# Altium project RasberryPTCC.PrjPcb
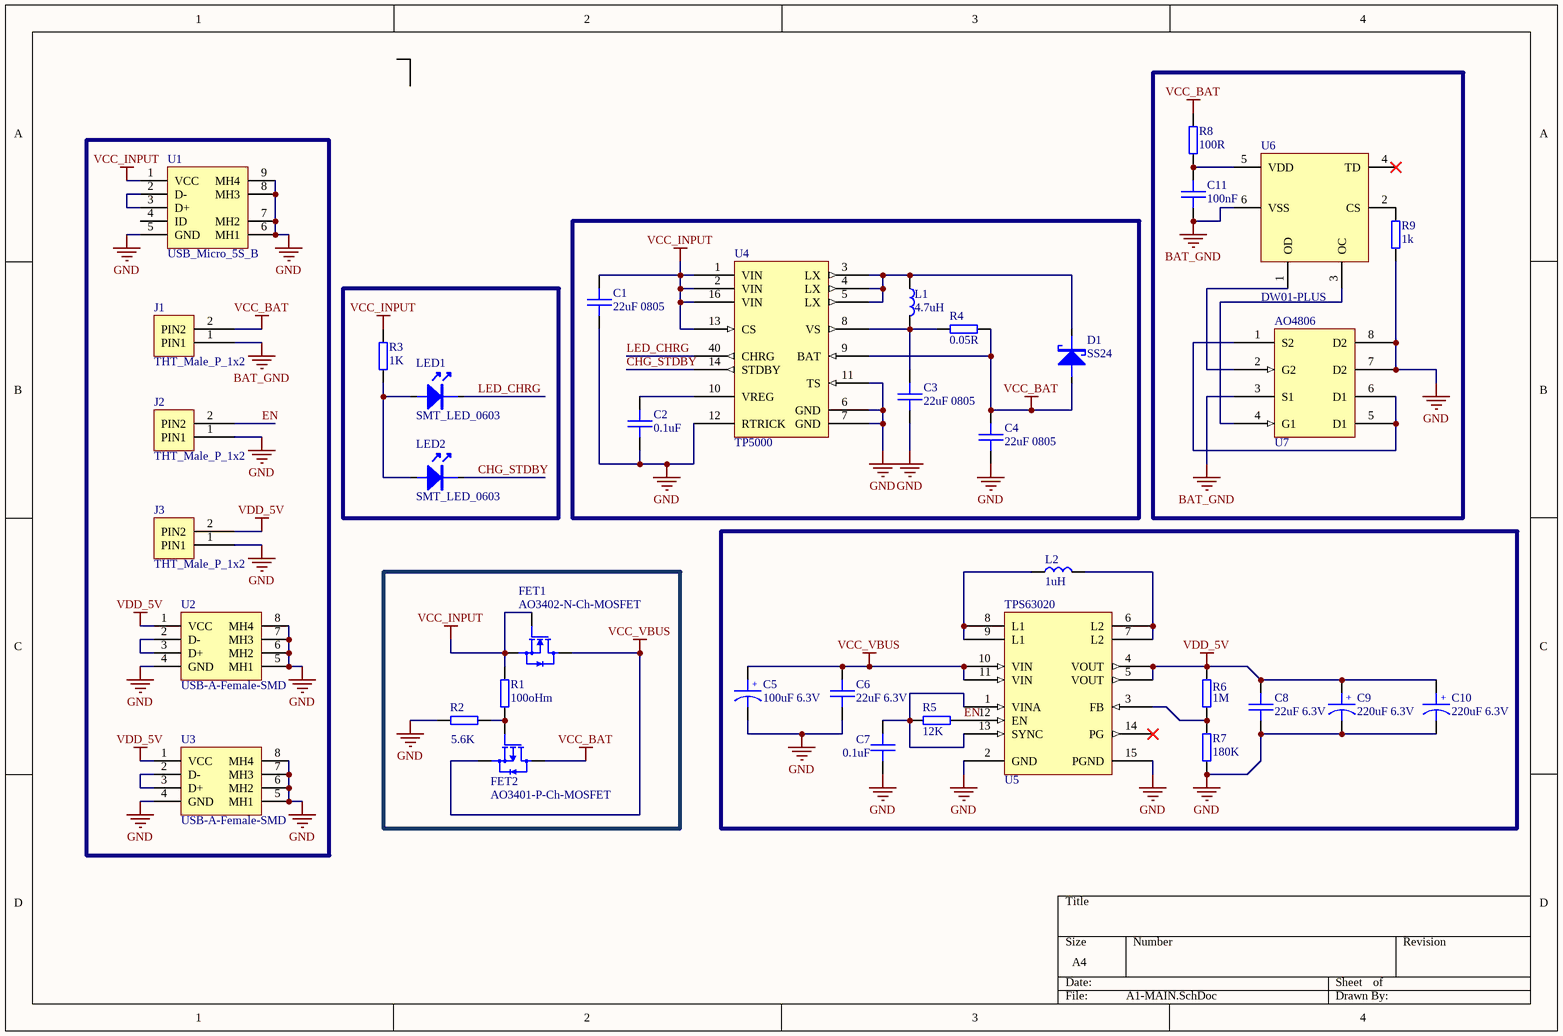
[diagram p0: A1-MAIN.SchDoc]
1 sheet, 37 parts. Net scope: global (net labels, ports and power ports of the same name join across sheets).
Board files: A00B01-AST.PcbDoc, A00B02-PURE.PcbDoc, A00B02-拼版.PcbDoc

## Sheet A1-MAIN.SchDoc
size A4

### Parts
AO4806  U7  [SOP-8]
C1  22uF 0805  [SMT_C_0805]
C2  0.1uF  [SMT_C_0603]
C3  22uF 0805  [SMT_C_0805]
C4  22uF 0805  [SMT_C_0805]
C5  100uF 6.3V  [SMT_C_Tantalum_A]
C6  22uF 6.3V  [SMT_C_0805]
C7  0.1uF  [SMT_C_0603]
C8  22uF 6.3V  [SMT_C_0805]
C9  220uF 6.3V  [SMT_C_Tantalum_B]
C10  220uF 6.3V  [SMT_C_Tantalum_B]
C11  100nF  [SMT_C_0603]
D1  SS24  [SMT_DIODE_DO_214AC]
FET1  AO3402-N-Ch-MOSFET  [AO3402-N-Ch-MOSFET]
FET2  AO3401-P-Ch-MOSFET  [AO3401-P-Ch-MOSFET]
J1  THT_Male_P_1x2  [THT_Male_P_1x2-2.54mm]
J2  THT_Male_P_1x2  [THT_Male_P_1x2-2.54mm]
J3  THT_Male_P_1x2  [THT_Male_P_1x2-2.54mm]
L1  4.7uH  [SMT_L_11.5mm]
L2  1uH  [SMT_L_11.5mm]
LED1  SMT_LED_0603  [SMT_LED_0603]
LED2  SMT_LED_0603  [SMT_LED_0603]
R1  100oHm  [SMT_R_0603]
R2  5.6K  [SMT_R_0603]
R3  1K  [SMT_R_0603]
R4  0.05R  [1210]
R5  12K  [SMT_R_0603]
R6  1M  [SMT_R_0603]
R7  180K  [SMT_R_0603]
R8  100R  [SMT_R_0603]
R9  1k  [SMT_R_0603]
TPS63020  U5  [VSON-14]
U1  USB_Micro_5S_B  [USB_MICRO_5S_B]
U2  USB-A-Female-SMD  [USB-A-SMD]
U3  USB-A-Female-SMD  [USB-A-SMD]
U4  TP5000  [QFN-16]
U6  DW01-PLUS  [SOT23-6]

### Nets
BAT_GND: AO4806.3(S1) C11.1 J1.1(PIN1) U6.6(VSS)
GND: AO4806.7(D2) AO4806.8(D2) C1.2 C2.1 C3.2 C4.2 C5.2 C6.2 C7.2 C8.2 C9.2 C10.2 J2.1(PIN1) J3.1(PIN1) R2.2 R7.1 R9.1 TPS63020.2(GND) TPS63020.15(PGND) U1.5(GND) U1.6(MH1) U1.7(MH2) U1.8(MH3) U1.9(MH4) U2.4(GND) U2.5(MH1) U2.6(MH2) U2.7(MH3) U2.8(MH4) U3.4(GND) U3.5(MH1) U3.6(MH2) U3.7(MH3) U3.8(MH4) U4.6(GND) U4.7(GND) U4.11(TS) U4.12(RTRICK)
VCC_BAT: C4.1 D1.1(A) FET2.3(D) J1.2(PIN2) R4.1 R8.1 U4.9(BAT)
VCC_INPUT: C1.1 FET1.1(G) FET1.2(S) R1.1 R3.2 U1.1(VCC) U4.1(VIN) U4.2(VIN) U4.13(CS) U4.16(VIN)
VCC_VBUS: C5.1 C6.1 FET1.3(D) FET2.2(S) TPS63020.10(VIN) TPS63020.11(VIN)
VDD_5V: C8.1 C9.1 C10.1 J3.2(PIN2) R6.2 TPS63020.4(VOUT) TPS63020.5(VOUT) U2.1(VCC) U3.1(VCC)
CHG_STDBY: LED2.2(K) U4.14(STDBY)
EN: J2.2(PIN2) R5.2 TPS63020.12(EN)
LED_CHRG: LED1.2(K) U4.40(CHRG)
NetAO4806_1: AO4806.1(S2) AO4806.5(D1) AO4806.6(D1)
NetAO4806_2: AO4806.2(G2) U6.1(OD)
NetAO4806_4: AO4806.4(G1) U6.3(OC)
NetC2_2: C2.2 U4.10(VREG)
NetC3_1: C3.1 L1.1 R4.2 U4.8(VS)
NetC7_1: C7.1 R5.1 TPS63020.1(VINA) TPS63020.13(SYNC)
NetC11_2: C11.2 R8.2 U6.5(VDD)
NetD1_2: D1.2(K) L1.2 U4.3(LX) U4.4(LX) U4.5(LX)
NetFET2_1: FET2.1(G) R1.2 R2.1
NetL2_1: L2.1 TPS63020.6(L2) TPS63020.7(L2)
NetL2_2: L2.2 TPS63020.8(L1) TPS63020.9(L1)
NetLED1_1: LED1.1(A) LED2.1(A) R3.1
NetR6_1: R6.1 R7.2 TPS63020.3(FB)
NetR9_2: R9.2 U6.2(CS)
NetU1_2: U1.2(D-) U1.3(D+)
NetU2_2: U2.2(D-) U2.3(D+)
NetU3_2: U3.2(D-) U3.3(D+)

Not connected (* = marked no-connect by the designer): TPS63020 14(PG)*; U1 4(ID); U6 4(TD)*

### Notes on the sheet
- (in symbol SMT_C_Tantalum_A) +
- (in symbol SMT_C_Tantalum_B) +

### Library data of the parts
AO4806 = AO4806
C1 C3 C4 C6 C8 = SMT_C_0805: Surface mount capacitor 0805
C2 C7 C11 = SMT_C_0603: Surface mount capacitor 0603
C5 = SMT_C_Tantalum_A: Capacitor, SM Tantalum; Body 3.2 x 1.6 mm (LxW typ)
C9 C10 = SMT_C_Tantalum_B: Capacitor, SM Tantalum; Body 3.5 x 2.8 mm (LxW typ)
D1 = SMT_DIODE_SCHOTTKY_DO_214AC: Surface mount schottky diode DO-214AC(SMA) Package
FET1 = AO3402-N-Ch-MOSFET: AO3402-N-Ch,4A,30V.RDS(ON) = 0.11Ω @ VGS = 2.5V
FET2 = AO3401-P-Ch-MOSFET: AO3401-P-Ch,-4.2A, -30V.RDS(ON) = 0.12Ω @ VGS = -2.5 V
J1-J3 = THT_Male_P_1x2: THT Male pin header strip 1x2
L1 L2 = SMT_L_11.5mm: Vishay HLP4040 SMT Inductor,11.5x11.5x4mm
LED1 LED2 = SMT_LED_0603: SMT LED
R1-R3 R5-R9 = SMT_R_0603: Surface mount resistor 0603
R4 = SMT_R_0805: Surface mount resistor 0805
TPS63020 = TPS63020
U1 = USB_Micro_5S_B: USB micro female SMT with 4 fixed foot
U6 = DW01-PLUS: One Cell Lithium-ion/Polymer Battery Protection IC